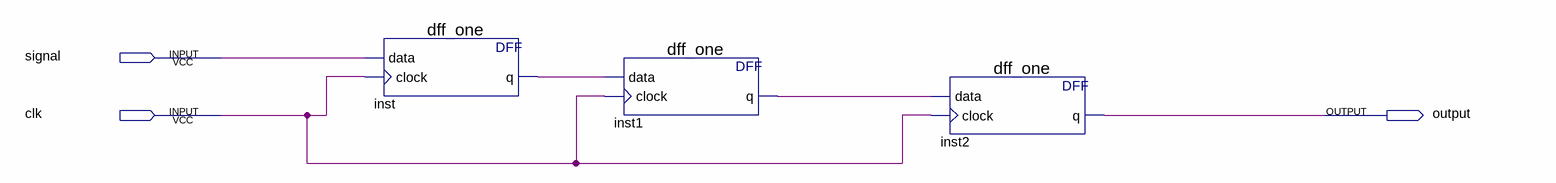
[diagram p0: schematic sheet]
// Quartus schematic ds0_delay.bdf as structural Verilog: 3 symbols, 3 pins
module ds0_delay (
  input  signal,
  input  clk,
  output \output 
);

  wire inst1_q, inst_q;

  dff_one inst (.data(signal), .clock(clk), .q(inst_q));
  dff_one inst1 (.data(inst_q), .clock(clk), .q(inst1_q));
  dff_one inst2 (.data(inst1_q), .clock(clk), .q(\output ));
endmodule
